# Altium schematic sheet PCB_DYBoard_Bandmaster_V2_SCH3.SchDoc
size A4; SheetNumber: 3; SheetTotal: 4; SPICEModelCacheXCLFXDFF: <root> / <DocumentId>XCLFXDFF</DocumentId> / </root>
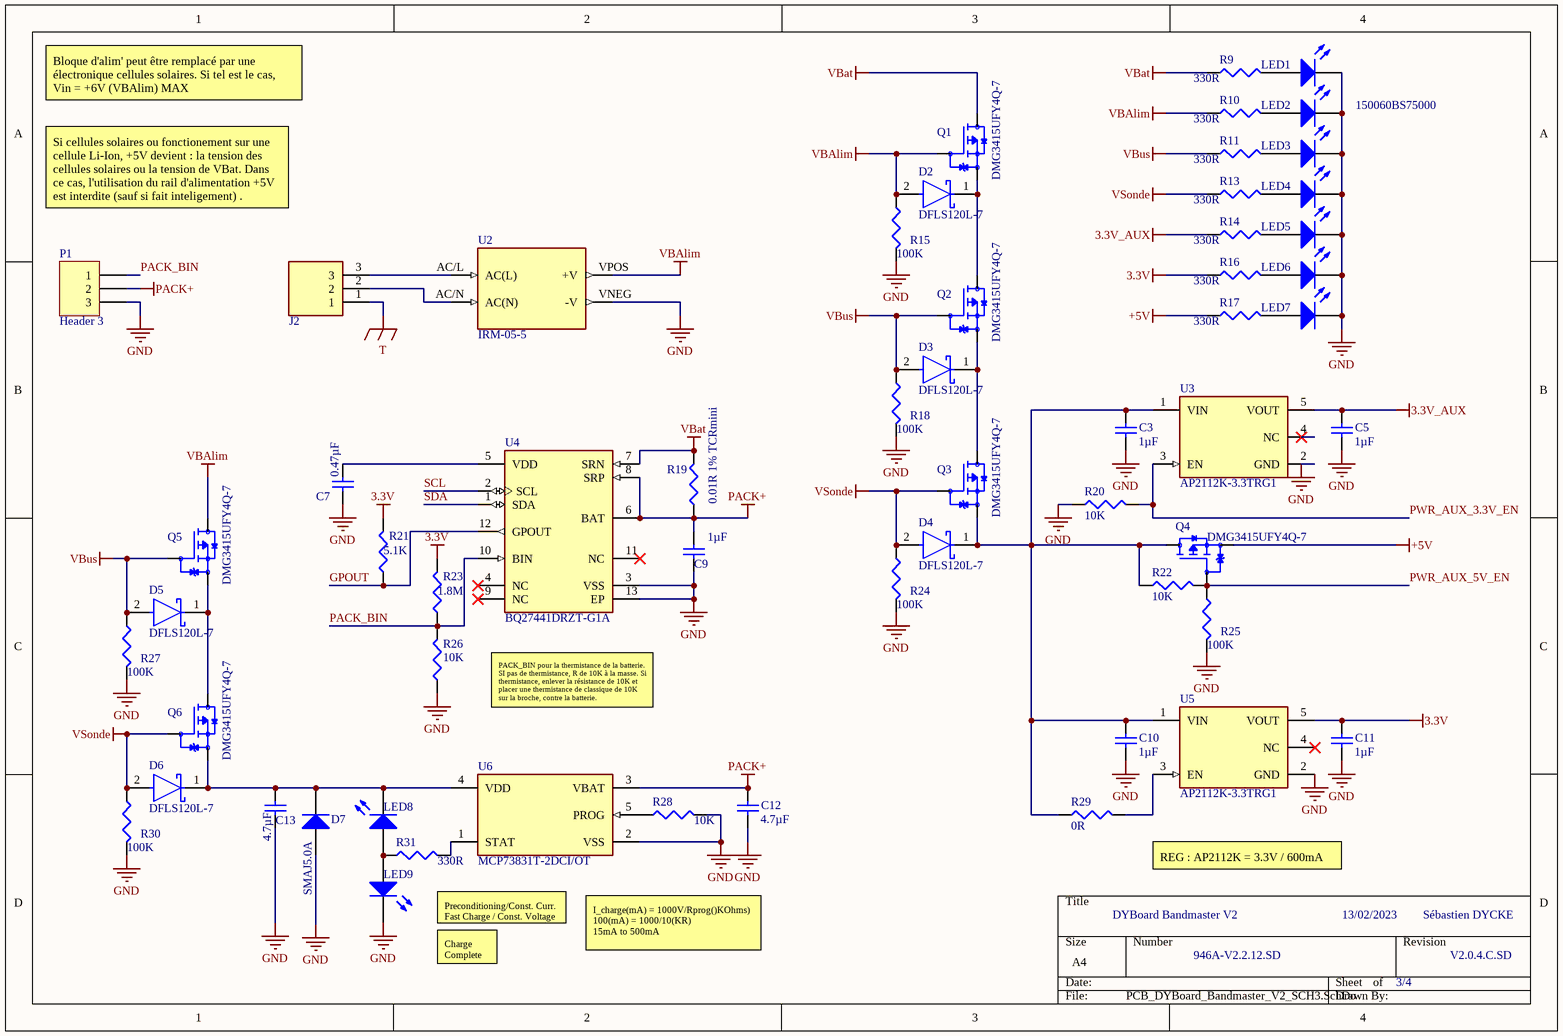
[diagram p0: PCB_DYBoard_Bandmaster_V2_SCH3.SchDoc]

## Parts
C3  value 1µF  [1608[0603]]  (hidden comment: Cap Semi)
C5  value 1µF  [1608[0603]]  (hidden comment: Cap Semi)
C7  value 0.47µF  [1608[0603]]  (hidden comment: Cap Semi)
C9  value 1µF  [1608[0603]]  (hidden comment: Cap Semi)
C10  value 1µF  [1608[0603]]  (hidden comment: Cap Semi)
C11  value 1µF  [1608[0603]]  (hidden comment: Cap Semi)
C12  value 4.7µF  [1608[0603]]  (hidden comment: Cap Semi)
C13  value 4.7µF  [1608[0603]]  (hidden comment: Cap Semi)
D2  DFLS120L-7  [FP-PowerDI123-MFG]
D3  DFLS120L-7  [FP-PowerDI123-MFG]
D4  DFLS120L-7  [FP-PowerDI123-MFG]
D5  DFLS120L-7  [FP-PowerDI123-MFG]
D6  DFLS120L-7  [FP-PowerDI123-MFG]
D7  SMAJ5.0A  [BOUR-SMA-2_V]
J2  TBP02R2-381-03BE  [CUI_TBP02R2-381-03BE]  (value not drawn)
LED1  150060BS75000  [0603_A]  (value not drawn)
LED2  150060BS75000  [0603_A]
LED3  150060BS75000  [0603_A]  (value not drawn)
LED4  150060BS75000  [0603_A]  (value not drawn)
LED5  150060BS75000  [0603_A]  (value not drawn)
LED6  150060BS75000  [0603_A]  (value not drawn)
LED7  150060BS75000  [0603_A]  (value not drawn)
LED8  150060BS75000  [0603_A]  (value not drawn)
LED9  150060BS75000  [0603_A]  (value not drawn)
P1  Header 3  [HDR1X3]
Q1  DMG3415UFY4Q-7  [TRANS_DMG3415UFY4Q-7]
Q2  DMG3415UFY4Q-7  [TRANS_DMG3415UFY4Q-7]
Q3  DMG3415UFY4Q-7  [TRANS_DMG3415UFY4Q-7]
Q4  DMG3415UFY4Q-7  [TRANS_DMG3415UFY4Q-7]
Q5  DMG3415UFY4Q-7  [TRANS_DMG3415UFY4Q-7]
Q6  DMG3415UFY4Q-7  [TRANS_DMG3415UFY4Q-7]
R9  value 330R  [J1-0603]  (hidden comment: Res3)
R10  value 330R  [J1-0603]  (hidden comment: Res3)
R11  value 330R  [J1-0603]  (hidden comment: Res3)
R13  value 330R  [J1-0603]  (hidden comment: Res3)
R14  value 330R  [J1-0603]  (hidden comment: Res3)
R15  value 100K  [J1-0603]  (hidden comment: Res3)
R16  value 330R  [J1-0603]  (hidden comment: Res3)
R17  value 330R  [J1-0603]  (hidden comment: Res3)
R18  value 100K  [J1-0603]  (hidden comment: Res3)
R19  value 0.01R 1% TCRmini  [J1-0603]  (hidden comment: Res3)
R20  value 10K  [J1-0603]  (hidden comment: Res3)
R21  value 5.1K  [J1-0603]  (hidden comment: Res3)
R22  value 10K  [J1-0603]  (hidden comment: Res3)
R23  value 1.8M  [J1-0603]  (hidden comment: Res3)
R24  value 100K  [J1-0603]  (hidden comment: Res3)
R25  value 100K  [J1-0603]  (hidden comment: Res3)
R26  value 10K  [J1-0603]  (hidden comment: Res3)
R27  value 100K  [J1-0603]  (hidden comment: Res3)
R28  value 10K  [J1-0603]  (hidden comment: Res3)
R29  value 0R  [J1-0603]  (hidden comment: Res3)
R30  value 100K  [J1-0603]  (hidden comment: Res3)
R31  value 330R  [J1-0603]  (hidden comment: Res3)
U2  IRM-05-5  [CONV_IRM-05-5]
U3  AP2112K-3.3TRG1  [FP-SOT25-IPC_A]
U4  BQ27441DRZT-G1A  [FP-DRZ0012A-MFG]
U5  AP2112K-3.3TRG1  [FP-SOT25-IPC_A]
U6  MCP73831T-2DCI/OT  [FP-C04-091-OT-IPC_B]

## Nets
3.3V: C11.2 R16.1 R21.2 R23.2 U5.5(VOUT)
3.3V_AUX: C5.2 R14.1 U3.5(VOUT)
+5V: Q4.2(S) R17.1
GND: C3.1 C5.1 C7.1 C9.1 C10.1 C11.1 C12.1 C13.1 D7.1(A) LED1.1(K) LED2.1(K) LED3.1(K) LED4.1(K) LED5.1(K) LED6.1(K) LED7.1(K) LED9.1(K) P1.3 R15.2 R18.2 R20.1 R24.2 R25.2 R26.1 R27.2 R28.2 R30.2 U2.VNEG(-V) U3.2(GND) U4.3(VSS) U4.13(EP) U5.2(GND) U6.2(VSS)
PACK+: C9.2 C12.2 P1.2 R19.1 U4.6(BAT) U4.8(SRP) U6.3(VBAT)
T: J2.1
VBAlim: D2.2(A) Q1.1(G) Q5.3(D) R10.1 R15.1 U2.VPOS(+V)
VBat: Q1.3(D) R9.1 R19.2 U4.7(SRN)
VBus: D3.2(A) D5.2(A) Q2.1(G) Q5.1(G) R11.1 R18.1 R27.1
VSonde: D4.2(A) D6.2(A) Q3.1(G) Q6.1(G) R13.1 R24.1 R30.1
GPOUT: R21.1 U4.12(GPOUT)
PACK_BIN: P1.1 R23.1 R26.2 U4.10(BIN)
PWR_AUX_3.3V_EN: R20.2 U3.3(EN)
PWR_AUX_5V_EN: Q4.1(G) R22.2 R25.1
SCL: U4.2(SCL)
SDA: U4.1(SDA)
NetC3_2: C3.2 C10.2 D4.1(C) Q3.2(S) Q4.3(D) R22.1 R29.1 U3.1(VIN) U5.1(VIN)
NetC7_2: C7.2 U4.5(VDD)
NetC13_2: C13.2 D6.1(C) D7.2(K) LED8.1(K) Q6.2(S) U6.4(VDD)
NetD2_1: D2.1(C) Q1.2(S) Q2.3(D)
NetD3_1: D3.1(C) Q2.2(S) Q3.3(D)
NetD5_1: D5.1(C) Q5.2(S) Q6.3(D)
NetJ2_2: J2.2 U2.AC/N(AC(N))
NetJ2_3: J2.3 U2.AC/L(AC(L))
NetLED1_2: LED1.2(A) R9.2
NetLED2_2: LED2.2(A) R10.2
NetLED3_2: LED3.2(A) R11.2
NetLED4_2: LED4.2(A) R13.2
NetLED5_2: LED5.2(A) R14.2
NetLED6_2: LED6.2(A) R16.2
NetLED7_2: LED7.2(A) R17.2
NetLED8_2: LED8.2(A) LED9.2(A) R31.1
NetR28_1: R28.1 U6.5(PROG)
NetR29_2: R29.2 U5.3(EN)
NetR31_2: R31.2 U6.1(STAT)

Not connected (* = marked no-connect by the designer): U3 4(NC)*; U4 4(NC)* 9(NC)* 11(NC)*; U5 4(NC)*

## Notes on the sheet
- Bloque d'alim' peut être remplacé par une électronique cellules solaires. Si tel est le cas, Vin = +6V (VBAlim) MAX
- Si cellules solaires ou fonctionement sur une cellule Li-Ion, +5V devient : la tension des cellules solaires ou la tension de VBat. Dans ce cas, l'utilisation du rail d'alimentation +5V est interdite (sauf si fait inteligement) .
- PACK_BIN pour la thermistance de la batterie. SI pas de thermistance, R de 10K à la masse. Si thermistance, enlever la résistance de 10K et placer une thermistance de classique de 10K sur la broche, contre la batterie.
- Preconditioning/Const. Curr. Fast Charge / Const. Voltage
- DYBoard Bandmaster V2
- REG : AP2112K = 3.3V / 600mA
- 13/02/2023
- Sébastien DYCKE
- Charge Complete
- I_charge(mA) = 1000V/Rprog()KOhms) 100(mA) = 1000/10(KR)                   15mA to 500mA
- 946A-V2.2.12.SD
- 3/4
- V2.0.4.C.SD

## Library data of the parts
C3 C5 C7 C9-C13 = Cap Semi: Capacitor (Semiconductor SIM Model); Published: 8-Jun-2000; LatestRevisionDate: 29-May-2009; LatestRevisionNote: IPC-7351 Footprint Added.; PackageReference: C1206; Publisher: Altium Limited; PackageDescription: Chip Capacitor
D2-D6 = CMP-12790-000036-1: DIODE SCHOTTKY 20V 1A POWERDI123; Manufacturer: Diodes Inc.; Value: 75pF; Automotive Grade: Grade 1; Max Junction Temp: +125°C; Peak Reverse Current: 1mA; Max Surge Forward Current: 50A; Height: 1mm; Footprint Url: https://www.diodes.com/assets/Package-Files/PowerDI123.pdf; Device Class L3: Schottky Diodes; Mouser Description: Schottky Diodes & Rectifiers 1A 20V; Lead Free: Yes; Reverse Voltage: 20V; Forward Current: 1A; ComponentLink2Description: Datasheet; Automotive: Yes; Max Repetitive Reverse Voltage: 20V; Package: PowerDI123; RoHS: TRUE; Octopart: https://octopart.com/dfls120l-7-diodes+inc.-328569; ComponentLink2URL: https://www.diodes.com/assets/Datasheets/ds30444.pdf; Temperature: -55°C to +125°C; Temperature Range Low: -55°C; Device Class L1: Discrete Semiconductors; Category: Diode; Device Class L2: Diodes; Digikey Description: DIODE SCHOTTKY 20V 1A POWERDI123; Capacitance: 75pF; Temperature Range High: +125°C; Manufacturer Part Number: DFLS120L-7
D7 = CMP-2000-07090-1: SMAJ Transient Voltage Suppressor Diode Series, 3.5 V, -55 to 150 degC, 2-Pin SMA, RoHS, Tape and Reel; Manufacturer: Bourns; EDA / CAD Models: DownloadfromAcceleratedDesigns; Unidirectional Channels: 1; Voltage - Breakdown (Min): 6.4V; Voltage - Reverse Standoff (Typ): 5V; Voltage - Clamping (Max) @ Ipp: 9.2V; Other Names: SMAJ5.0ABDKR; Type: Zener; Catalog Drawings: SMAJSeriesFootprintSMAJ,SMBJSeries; Featured Product: SMAJ/SMBJ/SMCJ/SMLJDiscreteTVSDiodes; Power - Peak Pulse: 400W; Current - Peak Pulse (10/1000µs): 43.5A; Power Line Protection: No; Online Catalog: SMAJSeries; Supplier Device Package: SMA(DO-214AC); Operating Temperature: -55°C~150°C(TJ); Package Description: 2-Pin Surface Mount Device, Body 4.315 x 2.605 mm; Datasheet URL: https://datasheet.ciiva.com/25624/0900766b8112213b-25624680.pdf; Manufacturer URL: http://www.bourns.com/; Datasheet Version: 08/2012; Series: SMAJ; Family: TVS-Diodes; Bidirectional Channels: -; Applications: GeneralPurpose; Package Reference: SMA-2; Standard Package: 1; Package / Case: DO-214AC,SMA; Category: CircuitProtection; RoHS Information: SMAJSeriesMaterialDeclaration; Mounting Technology: SurfaceMount; Capacitance @ Frequency: -; Packaging: Digi-Reel®; Mounting Type: SurfaceMount
J2 = TBP02R2-381-03BE: 2~24 Poles, Pluggable, Receptacle, Vertical, 3.81 Pitch, Terminal Block Connector; MF: CUI Devices; CUI_purchase_URL: https://www.cuidevices.com/product/interconnect/connectors/terminal-blocks/tbp02r2-381-series?utm_source=snapeda.com&utm_medium=referral&utm_campaign=snapedaBOM; Value: *; Price: None; Check_prices: https://www.snapeda.com/parts/TBP02R2-381-03BE/CUI+Devices/view-part/?ref=eda; Package: None; Availability: In Stock; Purchase-URL: https://pricing.snapeda.com/search/part/TBP02R2-381-03BE/?ref=eda; SnapEDA_Link: https://www.snapeda.com/parts/TBP02R2-381-03BE/CUI+Devices/view-part/?ref=snap; MP: TBP02R2-381-03BE
LED1-LED9 = CMP-1426-00003-1: SMD mono-color Chip LED, WL-SMCW, Blue; Manufacturer: Wuerth Elektronik; Color: Blue; ComponentLink2Description: Datasheet; ComponentLink2URL: http://katalog.we-online.com/led/datasheet/150060BS75000.pdf; ComponentLink1URL: http://www.we-online.com; PackageReference: 0603_A; PartNumber: 150060BS75000; ComponentLink1Description: Manufacturer URL
P1 = Header 3: Header, 3-Pin; LatestRevisionDate: 17-Jul-2002; LatestRevisionNote: Re-released for DXP Platform.; Publisher: Altium Limited
Q1-Q6 = DMG3415UFY4Q-7: P-Channel 16V 2.5A _Ta_ 650mW _Ta_ Surface Mount X2-DFN2015-3; MF: Diodes Inc.; SnapEDA_Link: https://www.snapeda.com/parts/DMG3415UFY4Q-7/Diodes%20Inc./view-part/653971/?ref=snap; MP: DMG3415UFY4Q-7; Value: *; Package: DFN-2 Diodes Inc.; Digi-Key_Part_Number: DMG3415UFY4Q-7DICT-ND
R9-R11 R13-R31 = Res3: Resistor; Published: 8-Jun-2000; LatestRevisionDate: 29-May-2009; LatestRevisionNote: IPC-7351 Footprint Added.; PackageReference: J1-0603; Publisher: Altium Limited; PackageDescription: Chip Resistor
U2 = IRM-05-5: Enclosed AC DC Converters 1 Uitgang 5V 1A 85 ~ 305 VAC, 120 ~ 430 VDC Input; MF: MEAN WELL; MP: IRM-05-5; Availability: Unavailable; Package: DIP-4 Mean Well; Value: *; Price: None; SnapEDA_Link: https://www.snapeda.com/parts/IRM-05-5/MEAN%20WELL%20USA%20Inc./view-part/364712/?ref=snap
U3 U5 = CMP-12756-000035-1: IC REG LINEAR 3.3V 600MA SOT25; Number of Regulators: 1; Output Type: Fixed; Polarity: Positive; Min Input Voltage: 2.5V; Max Input Voltage: 6V; Accuracy: 1.5%; Quiescent Current: 55uA; Dropout Voltage: 250mV; Min Operating Temperature: -40°C; Length: 3.1mm; Output Current: 600mA; Max Operating Temperature: 85°C; Package Quantity: 1; Output Voltage: 3.3V; Width: 1.7mm; Number of Outputs: 1; Packaging: Tape and Reel; Height: 1.3mm; Lead Free: Lead Free; Max Output Current: 600mA; Case/Package: SOT-23-5; Mount: Surface Mount; Number of Pins: 5
U4 = CMP-04911-000005-1: IC BATT FUEL GAUGE LICOO2 12SON; Manufacturer: Texas Instruments; Nominal Supply Current: 93uA; Standoff Height: 0mm; Output Voltage: 1.8V; Number Of Outputs: 1; Min Supply Voltage: 2.45V; Max Supply Voltage: 4.5V; ComponentLink2URL: http://www.ti.com/lit/ds/symlink/bq27441-g1.pdf; Device Class L1: Integrated Circuits (ICs); Package: DRZ0012A; Number Of Cells: 1; Mouser Description: Battery Management System-Side Impdance Trck Bttry Fuel Gge; ComponentLink2Description: Datasheet; Device Class L2: Power Management ICs; Temperature Range High: +85°C; Category: IC; Automotive: No; Octopart: https://octopart.com/bq27441drzt-g1a-texas+instruments-30555831; Temperature Range Low: -40°C; Device Class L3: Battery Management; RoHS: TRUE; Height: 1mm; Digikey Description: IC BATT FUEL GAUGE LICOO2 12SON; Temperature: -40°C to +85°C; Ambient Temperature Range High: +85°C; Ambient Temperature Range Low: -40°C; Manufacturer Part Number: BQ27441DRZT-G1A; Lead Free: Yes
U6 = CMP-0133-00146-2: IC CONTROLLR LI-ION 4.2V SOT23-5; Max Charge Current: 500mA; Min Output Voltage: 4.168V; Max Supply Voltage: 6V; Max Output Voltage: 4.232V; Number of Cells: 1; Operating Supply Current: 510uA; Min Supply Voltage: 3.75V; Max Output Current: 500mA; Case/Package: SOT-23; Radiation Hardening: No; REACH SVHC: No SVHC; Package Quantity: 3000; Output Current: 500mA; Number of Channels: 1; Output Voltage: 4.2V; Max Operating Temperature: 85°C; Number of Pins: 5; Mount: Surface Mount; Length: 3.1mm; Contact Plating: Tin; Packaging: Tape and Reel; Width: 1.8mm; Min Operating Temperature: -40°C; Max Input Voltage: 3.75V; Height: 1.3mm; Lead Free: Lead Free